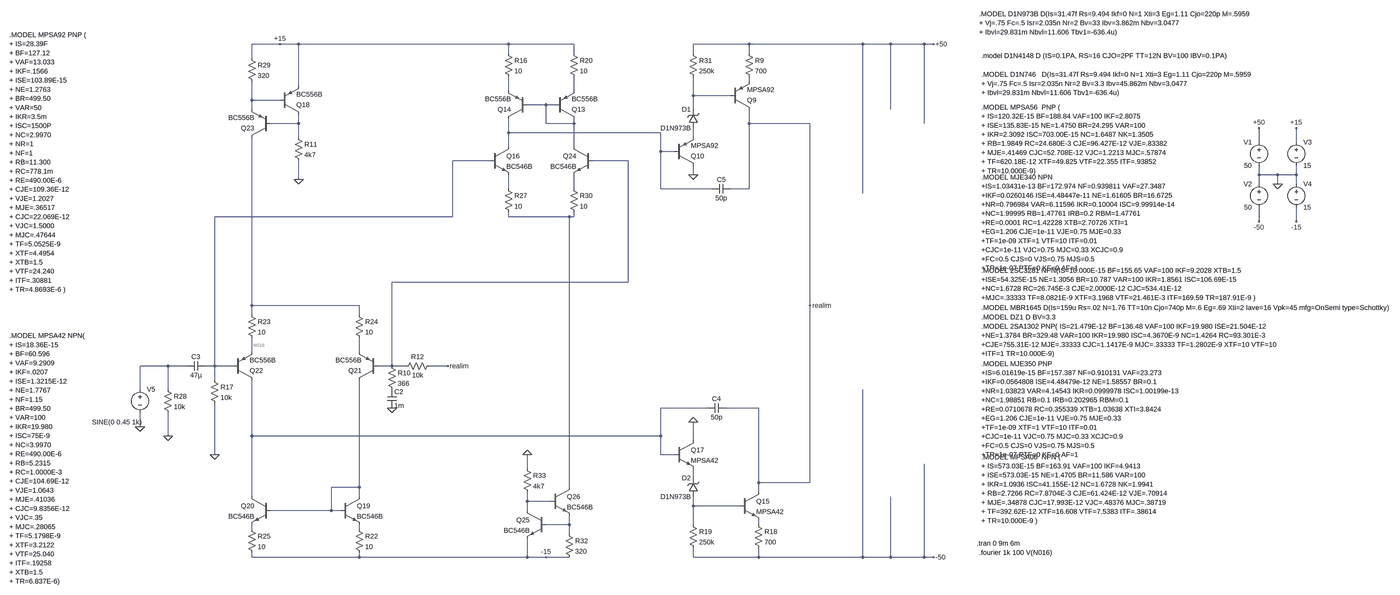
[diagram p0: schematic Clase G05112015 doble par diferencial sinpot.asc, whole sheet]
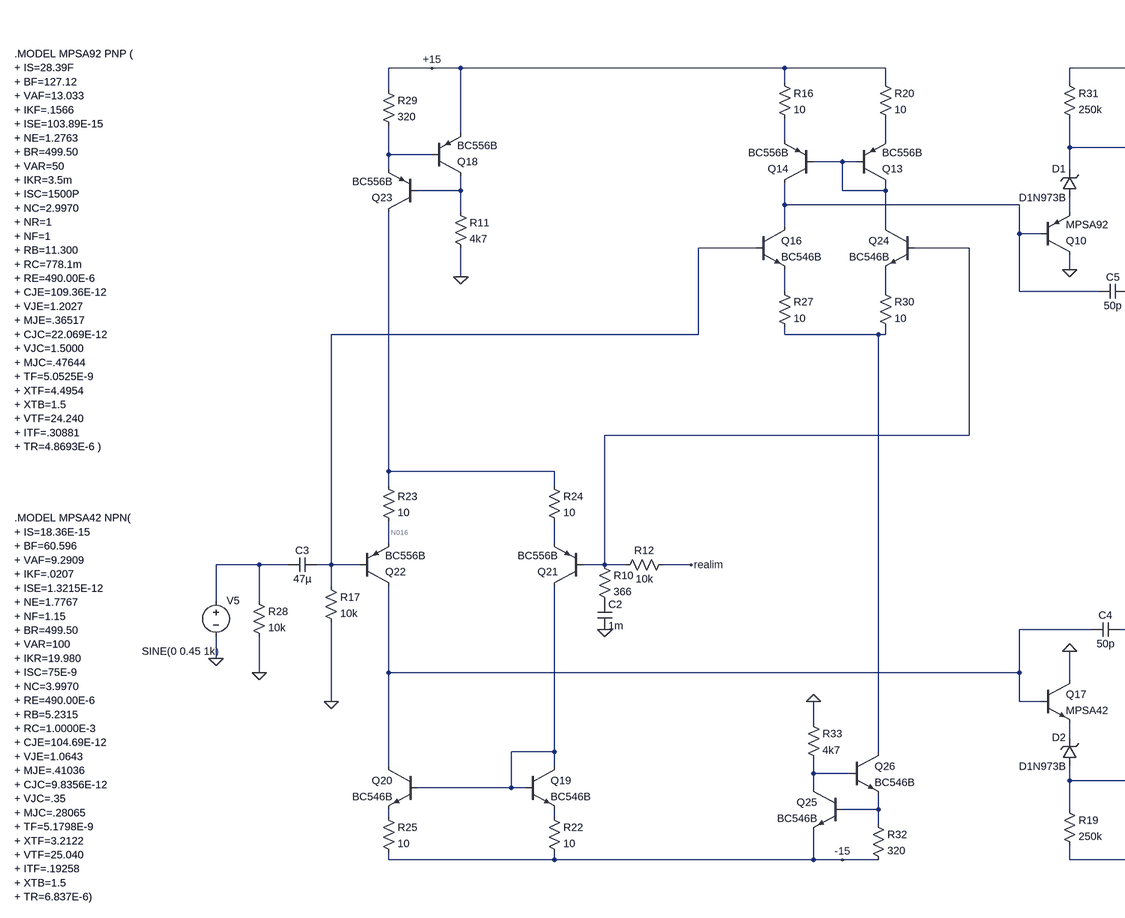
[diagram p1: schematic Clase G05112015 doble par diferencial sinpot.asc, part, row 1 of 1, column 1 of 2]
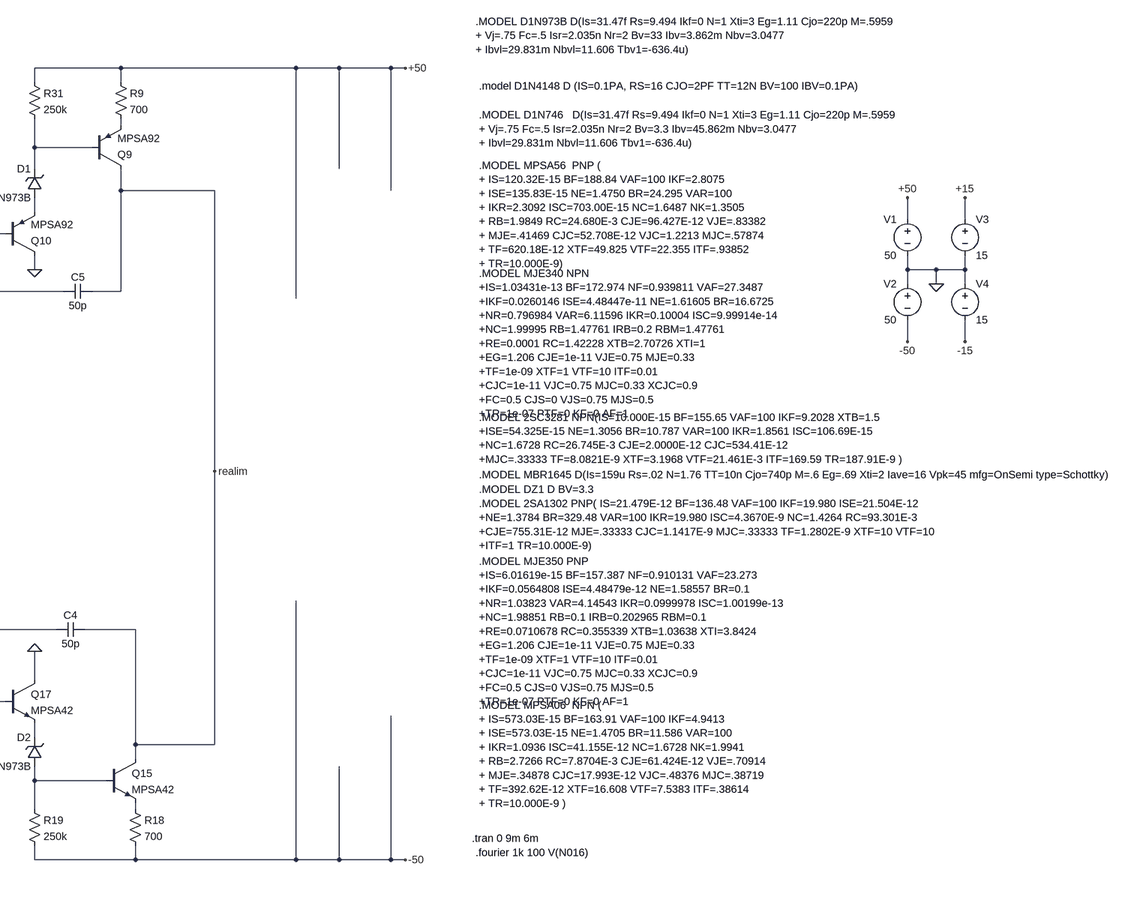
[diagram p2: schematic Clase G05112015 doble par diferencial sinpot.asc, part, row 1 of 1, column 2 of 2]
Clase G05112015 doble par diferencial sinpot.asc, the LTspice schematic file:
Version 4
SHEET 1 4608 680
WIRE -112 -1584 -208 -1584
WIRE -48 -1584 -112 -1584
WIRE 672 -1584 -48 -1584
WIRE 896 -1584 672 -1584
WIRE 1552 -1584 1360 -1584
WIRE 2016 -1584 1552 -1584
WIRE 2112 -1584 2016 -1584
WIRE 2240 -1584 2112 -1584
WIRE 2272 -1584 2240 -1584
WIRE 672 -1552 672 -1584
WIRE 896 -1552 896 -1584
WIRE 1360 -1552 1360 -1584
WIRE 1552 -1552 1552 -1584
WIRE -208 -1536 -208 -1584
WIRE 1552 -1456 1552 -1472
WIRE -48 -1440 -48 -1584
WIRE 672 -1424 672 -1472
WIRE 896 -1424 896 -1472
WIRE 1360 -1408 1360 -1472
WIRE 1488 -1408 1360 -1408
WIRE -208 -1392 -208 -1456
WIRE -112 -1392 -208 -1392
WIRE 800 -1376 736 -1376
WIRE 832 -1376 800 -1376
WIRE -208 -1360 -208 -1392
WIRE 1360 -1360 1360 -1408
WIRE 2112 -1360 2112 -1584
WIRE -48 -1312 -48 -1344
WIRE -48 -1312 -144 -1312
WIRE 800 -1312 800 -1376
WIRE 896 -1312 896 -1328
WIRE 896 -1312 800 -1312
WIRE 1552 -1312 1552 -1360
WIRE 1760 -1312 1552 -1312
WIRE 2240 -1312 2240 -1584
WIRE 672 -1280 672 -1328
WIRE 1248 -1280 672 -1280
WIRE -48 -1264 -48 -1312
WIRE 1360 -1264 1360 -1296
WIRE 3408 -1248 3408 -1296
WIRE 3536 -1248 3536 -1296
WIRE 672 -1232 672 -1280
WIRE 896 -1232 896 -1312
WIRE 1248 -1216 1248 -1280
WIRE 1296 -1216 1248 -1216
WIRE 608 -1184 480 -1184
WIRE 1088 -1184 960 -1184
WIRE 1360 -1136 1360 -1168
WIRE 3408 -1136 3408 -1168
WIRE 3472 -1136 3408 -1136
WIRE 3536 -1136 3536 -1168
WIRE 3536 -1136 3472 -1136
WIRE -48 -1120 -48 -1184
WIRE 3408 -1104 3408 -1136
WIRE 3472 -1104 3472 -1136
WIRE 3536 -1104 3536 -1136
WIRE 672 -1088 672 -1136
WIRE 896 -1088 896 -1136
WIRE 1248 -1088 1248 -1216
WIRE 1424 -1088 1248 -1088
WIRE 1552 -1088 1552 -1312
WIRE 1552 -1088 1488 -1088
WIRE 2016 -1072 2016 -1584
WIRE 480 -992 480 -1184
WIRE 480 -992 -336 -992
WIRE 672 -992 672 -1008
WIRE 880 -992 672 -992
WIRE 896 -992 896 -1008
WIRE 896 -992 880 -992
WIRE 3408 -976 3408 -1024
WIRE 3536 -976 3536 -1024
WIRE 1088 -768 1088 -1184
WIRE 1088 -768 272 -768
WIRE -208 -688 -208 -1264
WIRE 160 -688 -208 -688
WIRE 1760 -688 1760 -1312
WIRE -208 -656 -208 -688
WIRE 160 -656 160 -688
WIRE -208 -528 -208 -576
WIRE 160 -528 160 -576
WIRE -496 -480 -592 -480
WIRE -432 -480 -496 -480
WIRE -336 -480 -336 -992
WIRE -336 -480 -368 -480
WIRE -272 -480 -336 -480
WIRE 272 -480 272 -768
WIRE 272 -480 224 -480
WIRE 320 -480 272 -480
WIRE 464 -480 400 -480
WIRE -336 -432 -336 -480
WIRE -592 -400 -592 -480
WIRE -496 -400 -496 -480
WIRE 1408 -336 1248 -336
WIRE 1584 -336 1472 -336
WIRE -592 -272 -592 -320
WIRE -496 -240 -496 -320
WIRE -208 -240 -208 -432
WIRE 1248 -240 1248 -336
WIRE 1248 -240 -208 -240
WIRE 1360 -224 1360 -288
WIRE 160 -192 160 -432
WIRE -336 -176 -336 -352
WIRE -208 -176 -208 -240
WIRE 1248 -176 1248 -240
WIRE 1296 -176 1248 -176
WIRE 736 -128 736 -176
WIRE 1360 -96 1360 -128
WIRE 1584 -80 1584 -336
WIRE 1760 -80 1760 -688
WIRE 1760 -80 1584 -80
WIRE 160 -64 160 -192
WIRE 160 -64 64 -64
WIRE 880 -64 880 -992
WIRE 1584 -48 1584 -80
WIRE -208 -32 -208 -176
WIRE 160 -32 160 -64
WIRE 736 -16 736 -48
WIRE 816 -16 736 -16
WIRE 1360 0 1360 -32
WIRE 1520 0 1360 0
WIRE 64 16 64 -64
WIRE 64 16 -144 16
WIRE 96 16 64 16
WIRE 736 16 736 -16
WIRE 880 64 880 32
WIRE 880 64 800 64
WIRE 1360 64 1360 0
WIRE 1584 64 1584 48
WIRE -208 80 -208 64
WIRE 160 80 160 64
WIRE 880 96 880 64
WIRE -208 176 -208 160
WIRE 160 176 160 160
WIRE 160 176 -208 176
WIRE 736 176 736 112
WIRE 736 176 160 176
WIRE 800 176 736 176
WIRE 880 176 800 176
WIRE 1360 176 1360 144
WIRE 1584 176 1584 144
WIRE 1584 176 1360 176
WIRE 2016 176 2016 -400
WIRE 2016 176 1584 176
WIRE 2112 176 2112 -32
WIRE 2112 176 2016 176
WIRE 2240 176 2240 -144
WIRE 2240 176 2112 176
WIRE 2272 176 2240 176
FLAG 2272 176 -50
FLAG 2272 -1584 +50
FLAG 3408 -1296 +50
FLAG 3408 -976 -50
FLAG 3536 -1296 +15
FLAG 3536 -976 -15
FLAG 3472 -1104 0
FLAG 1360 -288 0
FLAG -592 -272 0
FLAG -48 -1120 0
FLAG -336 -176 0
FLAG 272 -336 0
FLAG -112 -1584 +15
FLAG -496 -240 0
FLAG 464 -480 realim
FLAG 736 -176 0
FLAG 1760 -688 realim
FLAG 800 176 -15
FLAG 1360 -1136 0
DATAFLAG -208 -176 ""
DATAFLAG 160 -192 ""
SYMBOL voltage 3408 -1264 M0
SYMATTR InstName V1
SYMATTR Value 50
SYMBOL voltage 3408 -1120 M0
SYMATTR InstName V2
SYMATTR Value 50
SYMBOL voltage 3536 -1264 R0
SYMATTR InstName V3
SYMATTR Value 15
SYMBOL voltage 3536 -1120 R0
SYMATTR InstName V4
SYMATTR Value 15
SYMBOL npn 1520 -48 R0
SYMATTR InstName Q15
SYMATTR Value MPSA42
SYMBOL res 1568 48 R0
SYMATTR InstName R18
SYMATTR Value 700
SYMBOL npn 1296 -224 R0
SYMATTR InstName Q17
SYMATTR Value MPSA42
SYMBOL res 1344 48 R0
SYMATTR InstName R19
SYMATTR Value 250k
SYMBOL npn 96 -32 R0
SYMATTR InstName Q19
SYMATTR Value BC546B
SYMBOL npn -144 -32 M0
SYMATTR InstName Q20
SYMATTR Value BC546B
SYMBOL pnp 224 -432 R180
SYMATTR InstName Q21
SYMATTR Value BC556B
SYMBOL voltage -592 -416 R0
WINDOW 123 -165 100 Left 2
WINDOW 39 0 0 Left 2
WINDOW 3 -165 128 Left 2
SYMATTR Value SINE(0 0.45 1k)
SYMATTR InstName V5
SYMBOL pnp -272 -432 M180
SYMATTR InstName Q22
SYMATTR Value BC556B
SYMBOL res 144 64 R0
SYMATTR InstName R22
SYMATTR Value 10
SYMBOL res -224 -672 R0
SYMATTR InstName R23
SYMATTR Value 10
SYMBOL res 144 -672 R0
SYMATTR InstName R24
SYMATTR Value 10
SYMBOL res -224 64 R0
SYMATTR InstName R25
SYMATTR Value 10
SYMBOL pnp -112 -1344 M180
SYMATTR InstName Q18
SYMATTR Value BC556B
SYMBOL res -64 -1280 R0
SYMATTR InstName R11
SYMATTR Value 4k7
SYMBOL pnp -144 -1264 R180
SYMATTR InstName Q23
SYMATTR Value BC556B
SYMBOL res 256 -496 R0
SYMATTR InstName R10
SYMATTR Value 366
SYMBOL res 416 -496 R90
WINDOW 0 0 56 VBottom 2
WINDOW 3 32 56 VTop 2
SYMATTR InstName R12
SYMATTR Value 10k
SYMBOL res -352 -448 R0
SYMATTR InstName R17
SYMATTR Value 10k
SYMBOL cap 256 -400 R0
SYMATTR InstName C2
SYMATTR Value 1m
SYMBOL cap -368 -496 R90
WINDOW 0 0 32 VBottom 2
WINDOW 3 32 32 VTop 2
SYMATTR InstName C3
SYMATTR Value 47µ
SYMBOL cap 1472 -352 R90
WINDOW 0 0 32 VBottom 2
WINDOW 3 32 32 VTop 2
SYMATTR InstName C4
SYMATTR Value 50p
SYMBOL res -512 -416 R0
SYMATTR InstName R28
SYMATTR Value 10k
SYMBOL res -224 -1552 R0
SYMATTR InstName R29
SYMATTR Value 320
SYMBOL res 656 -1568 R0
SYMATTR InstName R16
SYMATTR Value 10
SYMBOL res 880 -1568 R0
SYMATTR InstName R20
SYMATTR Value 10
SYMBOL pnp 832 -1328 M180
SYMATTR InstName Q13
SYMATTR Value BC556B
SYMBOL pnp 736 -1328 R180
SYMATTR InstName Q14
SYMATTR Value BC556B
SYMBOL npn 608 -1232 R0
SYMATTR InstName Q16
SYMATTR Value BC546B
SYMBOL npn 960 -1232 M0
SYMATTR InstName Q24
SYMATTR Value BC546B
SYMBOL res 656 -1104 R0
SYMATTR InstName R27
SYMATTR Value 10
SYMBOL res 880 -1104 R0
SYMATTR InstName R30
SYMATTR Value 10
SYMBOL res 1536 -1568 R0
SYMATTR InstName R9
SYMATTR Value 700
SYMBOL pnp 1488 -1360 M180
SYMATTR InstName Q9
SYMATTR Value MPSA92
SYMBOL pnp 1296 -1168 M180
SYMATTR InstName Q10
SYMATTR Value MPSA92
SYMBOL cap 1488 -1104 R90
WINDOW 0 0 32 VBottom 2
WINDOW 3 32 32 VTop 2
SYMATTR InstName C5
SYMATTR Value 50p
SYMBOL res 1344 -1568 R0
SYMATTR InstName R31
SYMATTR Value 250k
SYMBOL res 864 80 R0
SYMATTR InstName R32
SYMATTR Value 320
SYMBOL npn 800 16 M0
SYMATTR InstName Q25
SYMATTR Value BC546B
SYMBOL npn 816 -64 R0
SYMATTR InstName Q26
SYMATTR Value BC546B
SYMBOL res 720 -144 R0
SYMATTR InstName R33
SYMATTR Value 4k7
SYMBOL zener 1376 -1296 R180
WINDOW 0 24 64 Left 2
WINDOW 3 24 0 Left 2
SYMATTR InstName D1
SYMATTR Value D1N973B
SYMBOL zener 1376 -32 R180
WINDOW 0 24 64 Left 2
WINDOW 3 24 0 Left 2
SYMATTR InstName D2
SYMATTR Value D1N973B
TEXT 2456 -648 Left 2 !.MODEL DZ1 D BV=3.3
TEXT 2456 -1368 Left 2 !.MODEL MPSA56  PNP (\n+ IS=120.32E-15 BF=188.84 VAF=100 IKF=2.8075\n+ ISE=135.83E-15 NE=1.4750 BR=24.295 VAR=100\n+ IKR=2.3092 ISC=703.00E-15 NC=1.6487 NK=1.3505\n+ RB=1.9849 RC=24.680E-3 CJE=96.427E-12 VJE=.83382\n+ MJE=.41469 CJC=52.708E-12 VJC=1.2213 MJC=.57874\n+ TF=620.18E-12 XTF=49.825 VTF=22.355 ITF=.93852\n+ TR=10.000E-9)
TEXT 2456 -1128 Left 2 !.MODEL MJE340 NPN\n+IS=1.03431e-13 BF=172.974 NF=0.939811 VAF=27.3487\n+IKF=0.0260146 ISE=4.48447e-11 NE=1.61605 BR=16.6725\n+NR=0.796984 VAR=6.11596 IKR=0.10004 ISC=9.99914e-14\n+NC=1.99995 RB=1.47761 IRB=0.2 RBM=1.47761\n+RE=0.0001 RC=1.42228 XTB=2.70726 XTI=1\n+EG=1.206 CJE=1e-11 VJE=0.75 MJE=0.33\n+TF=1e-09 XTF=1 VTF=10 ITF=0.01\n+CJC=1e-11 VJC=0.75 MJC=0.33 XCJC=0.9\n+FC=0.5 CJS=0 VJS=0.75 MJS=0.5\n+TR=1e-07 PTF=0 KF=0 AF=1
TEXT 2456 -808 Left 2 !.MODEL 2SC3281 NPN(IS=10.000E-15 BF=155.65 VAF=100 IKF=9.2028 XTB=1.5\n+ISE=54.325E-15 NE=1.3056 BR=10.787 VAR=100 IKR=1.8561 ISC=106.69E-15\n+NC=1.6728 RC=26.745E-3 CJE=2.0000E-12 CJC=534.41E-12\n+MJC=.33333 TF=8.0821E-9 XTF=3.1968 VTF=21.461E-3 ITF=169.59 TR=187.91E-9 )
TEXT 2456 -680 Left 2 !.MODEL MBR1645 D(Is=159u Rs=.02 N=1.76 TT=10n Cjo=740p M=.6 Eg=.69 Xti=2 Iave=16 Vpk=45 mfg=OnSemi type=Schottky)
TEXT 2456 -616 Left 2 !.MODEL 2SA1302 PNP( IS=21.479E-12 BF=136.48 VAF=100 IKF=19.980 ISE=21.504E-12\n+NE=1.3784 BR=329.48 VAR=100 IKR=19.980 ISC=4.3670E-9 NC=1.4264 RC=93.301E-3\n+CJE=755.31E-12 MJE=.33333 CJC=1.1417E-9 MJC=.33333 TF=1.2802E-9 XTF=10 VTF=10\n+ITF=1 TR=10.000E-9)
TEXT 2456 -488 Left 2 !.MODEL MJE350 PNP\n+IS=6.01619e-15 BF=157.387 NF=0.910131 VAF=23.273\n+IKF=0.0564808 ISE=4.48479e-12 NE=1.58557 BR=0.1\n+NR=1.03823 VAR=4.14543 IKR=0.0999978 ISC=1.00199e-13\n+NC=1.98851 RB=0.1 IRB=0.202965 RBM=0.1\n+RE=0.0710678 RC=0.355339 XTB=1.03638 XTI=3.8424\n+EG=1.206 CJE=1e-11 VJE=0.75 MJE=0.33\n+TF=1e-09 XTF=1 VTF=10 ITF=0.01\n+CJC=1e-11 VJC=0.75 MJC=0.33 XCJC=0.9\n+FC=0.5 CJS=0 VJS=0.75 MJS=0.5\n+TR=1e-07 PTF=0 KF=0 AF=1
TEXT 2456 -168 Left 2 !.MODEL MPSA06  NPN (\n+ IS=573.03E-15 BF=163.91 VAF=100 IKF=4.9413\n+ ISE=573.03E-15 NE=1.4705 BR=11.586 VAR=100\n+ IKR=1.0936 ISC=41.155E-12 NC=1.6728 NK=1.9941\n+ RB=2.7266 RC=7.8704E-3 CJE=61.424E-12 VJE=.70914\n+ MJE=.34878 CJC=17.993E-12 VJC=.48376 MJC=.38719\n+ TF=392.62E-12 XTF=16.608 VTF=7.5383 ITF=.38614\n+ TR=10.000E-9 )
TEXT 2448 160 Left 2 !.fourier 1k 100 V(N016)
TEXT 2440 128 Left 2 !.tran 0 9m 6m
TEXT 2456 -1480 Left 2 !.MODEL D1N746   D(Is=31.47f Rs=9.494 Ikf=0 N=1 Xti=3 Eg=1.11 Cjo=220p M=.5959\n+ Vj=.75 Fc=.5 Isr=2.035n Nr=2 Bv=3.3 Ibv=45.862m Nbv=3.0477\n+ Ibvl=29.831m Nbvl=11.606 Tbv1=-636.4u)
TEXT 2456 -1544 Left 2 !.model D1N4148 D (IS=0.1PA, RS=16 CJO=2PF TT=12N BV=100 IBV=0.1PA)
TEXT -1040 -1616 Left 2 !.MODEL MPSA92 PNP (\n+ IS=28.39F\n+ BF=127.12\n+ VAF=13.033\n+ IKF=.1566\n+ ISE=103.89E-15\n+ NE=1.2763\n+ BR=499.50\n+ VAR=50\n+ IKR=3.5m\n+ ISC=1500P\n+ NC=2.9970\n+ NR=1\n+ NF=1\n+ RB=11.300\n+ RC=778.1m\n+ RE=490.00E-6\n+ CJE=109.36E-12\n+ VJE=1.2027\n+ MJE=.36517\n+ CJC=22.069E-12\n+ VJC=1.5000\n+ MJC=.47644\n+ TF=5.0525E-9\n+ XTF=4.4954\n+ XTB=1.5\n+ VTF=24.240\n+ ITF=.30881\n+ TR=4.8693E-6 )
TEXT -1040 -584 Left 2 !.MODEL MPSA42 NPN(\n+ IS=18.36E-15\n+ BF=60.596\n+ VAF=9.2909\n+ IKF=.0207\n+ ISE=1.3215E-12\n+ NE=1.7767\n+ NF=1.15\n+ BR=499.50\n+ VAR=100\n+ IKR=19.980\n+ ISC=75E-9\n+ NC=3.9970\n+ RE=490.00E-6\n+ RB=5.2315\n+ RC=1.0000E-3\n+ CJE=104.69E-12\n+ VJE=1.0643\n+ MJE=.41036\n+ CJC=9.8356E-12\n+ VJC=.35\n+ MJC=.28065\n+ TF=5.1798E-9\n+ XTF=3.2122\n+ VTF=25.040\n+ ITF=.19258\n+ XTB=1.5\n+ TR=6.837E-6)
TEXT 2448 -1688 Left 2 !.MODEL D1N973B D(Is=31.47f Rs=9.494 Ikf=0 N=1 Xti=3 Eg=1.11 Cjo=220p M=.5959\n+ Vj=.75 Fc=.5 Isr=2.035n Nr=2 Bv=33 Ibv=3.862m Nbv=3.0477\n+ Ibvl=29.831m Nbvl=11.606 Tbv1=-636.4u)

The netlist it stands for:
* Clase G05112015 doble par diferencial sinpot.asc
V1 +50 0 50
V2 0 -50 50
V3 +15 0 15
V4 0 -15 15
Q15 realim N023 N025 0 MPSA42
R18 N025 -50 700
Q17 0 N019 N021 0 MPSA42
R19 N023 -50 250k
Q19 N020 N020 N027 0 BC546B
Q20 N019 N020 N026 0 BC546B
Q21 N020 N011 N017 0 BC556B
V5 N018 0 SINE(0 0.45 1k)
Q22 N019 N010 N016 0 BC556B
R22 N027 -15 10
R23 N015 N016 10
R24 N015 N017 10
R25 N026 -15 10
Q18 N007 N005 +15 0 BC556B
R11 N007 0 4k7
Q23 N015 N007 N005 0 BC556B
R10 N011 P001 366
R12 realim N011 10k
R17 N010 0 10k
C2 P001 0 1m
C3 N010 N018 47µ
C4 realim N019 50p
R28 N018 0 10k
R29 +15 N005 320
R16 +15 N002 10
R20 +15 N003 10
Q13 N006 N006 N003 0 BC556B
Q14 N008 N006 N002 0 BC556B
Q16 N008 N010 N012 0 BC546B
Q24 N006 N011 N013 0 BC546B
R27 N012 N014 10
R30 N013 N014 10
R9 +50 N001 700
Q9 realim N004 N001 0 MPSA92
Q10 0 N008 N009 0 MPSA92
C5 realim N008 50p
R31 +50 N004 250k
R32 N024 -15 320
Q25 N022 N024 -15 0 BC546B
Q26 N014 N022 N024 0 BC546B
R33 0 N022 4k7
D1 N009 N004 D1N973B
D2 N023 N021 D1N973B
.model D D
.lib standard.dio
.model NPN NPN
.model PNP PNP
.lib standard.bjt
.MODEL DZ1 D BV=3.3
.MODEL MPSA56  PNP (
+ IS=120.32E-15 BF=188.84 VAF=100 IKF=2.8075
+ ISE=135.83E-15 NE=1.4750 BR=24.295 VAR=100
+ IKR=2.3092 ISC=703.00E-15 NC=1.6487 NK=1.3505
+ RB=1.9849 RC=24.680E-3 CJE=96.427E-12 VJE=.83382
+ MJE=.41469 CJC=52.708E-12 VJC=1.2213 MJC=.57874
+ TF=620.18E-12 XTF=49.825 VTF=22.355 ITF=.93852
+ TR=10.000E-9)
.MODEL MJE340 NPN
+IS=1.03431e-13 BF=172.974 NF=0.939811 VAF=27.3487
+IKF=0.0260146 ISE=4.48447e-11 NE=1.61605 BR=16.6725
+NR=0.796984 VAR=6.11596 IKR=0.10004 ISC=9.99914e-14
+NC=1.99995 RB=1.47761 IRB=0.2 RBM=1.47761
+RE=0.0001 RC=1.42228 XTB=2.70726 XTI=1
+EG=1.206 CJE=1e-11 VJE=0.75 MJE=0.33
+TF=1e-09 XTF=1 VTF=10 ITF=0.01
+CJC=1e-11 VJC=0.75 MJC=0.33 XCJC=0.9
+FC=0.5 CJS=0 VJS=0.75 MJS=0.5
+TR=1e-07 PTF=0 KF=0 AF=1
.MODEL 2SC3281 NPN(IS=10.000E-15 BF=155.65 VAF=100 IKF=9.2028 XTB=1.5
+ISE=54.325E-15 NE=1.3056 BR=10.787 VAR=100 IKR=1.8561 ISC=106.69E-15
+NC=1.6728 RC=26.745E-3 CJE=2.0000E-12 CJC=534.41E-12
+MJC=.33333 TF=8.0821E-9 XTF=3.1968 VTF=21.461E-3 ITF=169.59 TR=187.91E-9 )
.MODEL MBR1645 D(Is=159u Rs=.02 N=1.76 TT=10n Cjo=740p M=.6 Eg=.69 Xti=2 Iave=16 Vpk=45 mfg=OnSemi type=Schottky)
.MODEL 2SA1302 PNP( IS=21.479E-12 BF=136.48 VAF=100 IKF=19.980 ISE=21.504E-12
+NE=1.3784 BR=329.48 VAR=100 IKR=19.980 ISC=4.3670E-9 NC=1.4264 RC=93.301E-3
+CJE=755.31E-12 MJE=.33333 CJC=1.1417E-9 MJC=.33333 TF=1.2802E-9 XTF=10 VTF=10
+ITF=1 TR=10.000E-9)
.MODEL MJE350 PNP
+IS=6.01619e-15 BF=157.387 NF=0.910131 VAF=23.273
+IKF=0.0564808 ISE=4.48479e-12 NE=1.58557 BR=0.1
+NR=1.03823 VAR=4.14543 IKR=0.0999978 ISC=1.00199e-13
+NC=1.98851 RB=0.1 IRB=0.202965 RBM=0.1
+RE=0.0710678 RC=0.355339 XTB=1.03638 XTI=3.8424
+EG=1.206 CJE=1e-11 VJE=0.75 MJE=0.33
+TF=1e-09 XTF=1 VTF=10 ITF=0.01
+CJC=1e-11 VJC=0.75 MJC=0.33 XCJC=0.9
+FC=0.5 CJS=0 VJS=0.75 MJS=0.5
+TR=1e-07 PTF=0 KF=0 AF=1
.MODEL MPSA06  NPN (
+ IS=573.03E-15 BF=163.91 VAF=100 IKF=4.9413
+ ISE=573.03E-15 NE=1.4705 BR=11.586 VAR=100
+ IKR=1.0936 ISC=41.155E-12 NC=1.6728 NK=1.9941
+ RB=2.7266 RC=7.8704E-3 CJE=61.424E-12 VJE=.70914
+ MJE=.34878 CJC=17.993E-12 VJC=.48376 MJC=.38719
+ TF=392.62E-12 XTF=16.608 VTF=7.5383 ITF=.38614
+ TR=10.000E-9 )
.fourier 1k 100 V(N016)
.tran 0 9m 6m
.MODEL D1N746   D(Is=31.47f Rs=9.494 Ikf=0 N=1 Xti=3 Eg=1.11 Cjo=220p M=.5959
+ Vj=.75 Fc=.5 Isr=2.035n Nr=2 Bv=3.3 Ibv=45.862m Nbv=3.0477
+ Ibvl=29.831m Nbvl=11.606 Tbv1=-636.4u)
.model D1N4148 D (IS=0.1PA, RS=16 CJO=2PF TT=12N BV=100 IBV=0.1PA)
.MODEL MPSA92 PNP (
+ IS=28.39F
+ BF=127.12
+ VAF=13.033
+ IKF=.1566
+ ISE=103.89E-15
+ NE=1.2763
+ BR=499.50
+ VAR=50
+ IKR=3.5m
+ ISC=1500P
+ NC=2.9970
+ NR=1
+ NF=1
+ RB=11.300
+ RC=778.1m
+ RE=490.00E-6
+ CJE=109.36E-12
+ VJE=1.2027
+ MJE=.36517
+ CJC=22.069E-12
+ VJC=1.5000
+ MJC=.47644
+ TF=5.0525E-9
+ XTF=4.4954
+ XTB=1.5
+ VTF=24.240
+ ITF=.30881
+ TR=4.8693E-6 )
.MODEL MPSA42 NPN(
+ IS=18.36E-15
+ BF=60.596
+ VAF=9.2909
+ IKF=.0207
+ ISE=1.3215E-12
+ NE=1.7767
+ NF=1.15
+ BR=499.50
+ VAR=100
+ IKR=19.980
+ ISC=75E-9
+ NC=3.9970
+ RE=490.00E-6
+ RB=5.2315
+ RC=1.0000E-3
+ CJE=104.69E-12
+ VJE=1.0643
+ MJE=.41036
+ CJC=9.8356E-12
+ VJC=.35
+ MJC=.28065
+ TF=5.1798E-9
+ XTF=3.2122
+ VTF=25.040
+ ITF=.19258
+ XTB=1.5
+ TR=6.837E-6)
.MODEL D1N973B D(Is=31.47f Rs=9.494 Ikf=0 N=1 Xti=3 Eg=1.11 Cjo=220p M=.5959
+ Vj=.75 Fc=.5 Isr=2.035n Nr=2 Bv=33 Ibv=3.862m Nbv=3.0477
+ Ibvl=29.831m Nbvl=11.606 Tbv1=-636.4u)
.backanno
.end